# Altium schematic sheet IO Expanders.SchDoc
size A4
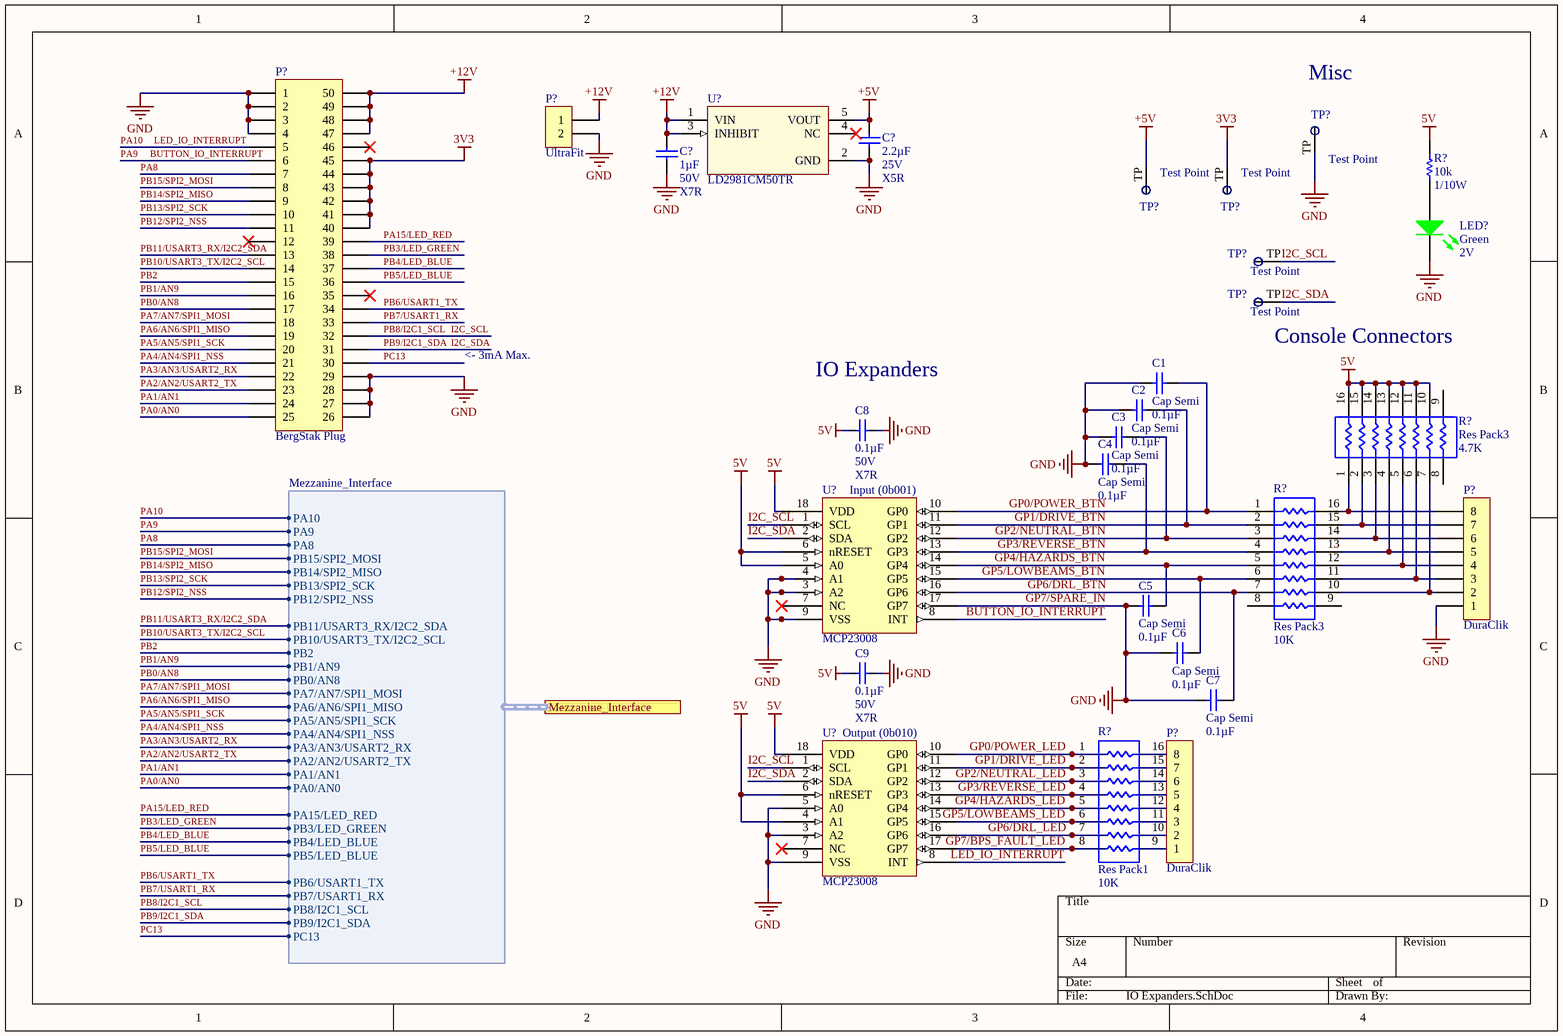
[diagram p0: IO Expanders.SchDoc]

## Parts
(Parts that share a designator on the sheet are numbered #1, #2 ... from top to bottom, then left to right.)
C1  Cap Semi  value 0.1µF  [C1206]
C2  Cap Semi  value 0.1µF  [C1206]
C3  Cap Semi  value 0.1µF  [C1206]
C4  Cap Semi  value 0.1µF  [C1206]
C5  Cap Semi  value 0.1µF  [C1206]
C6  Cap Semi  value 0.1µF  [C1206]
C7  Cap Semi  value 0.1µF  [C1206]
C8  Capacitance: 0.1µF  Voltage: 50V  Temperature Coefficient: X7R  [CAP, 0603]  (hidden comment: CAP CER 0.1UF 50V 10% X7R 0603)
C9  Capacitance: 0.1µF  Voltage: 50V  Temperature Coefficient: X7R  [CAP, 0603]  (hidden comment: CAP CER 0.1UF 50V 10% X7R 0603)
C?#1  Capacitance: 2.2µF  Voltage: 25V  Temperature Coefficient: X5R  [CAP, 0603]  (hidden comment: CAP CER 2.2UF 25V 10% X5R 0603)
C?#2  Capacitance: 1µF  Voltage: 50V  Temperature Coefficient: X7R  [CAP, 0603]  (hidden comment: CAP CER 1UF 50V 10% X7R 0603)
LED?  Color: Green  Voltage - Forward (Vf) (Typ): 2V  [LED_0603]  (hidden comment: LED GREEN CLEAR 2V 0603)
P?#1  Series: BergStak Plug  [CONN, Bergstak 50 Pos Plug]  (hidden comment: CONN 50POS Bergstak Plug 0.02")
P?#2  Series: UltraFit  [CONN, 2POS ULTRA-FIT]  (hidden comment: CONN 2POS ULTRA-FIT 0.138")
P?#3  Series: DuraClik  [CONN, 8POS Dura-Clik]  (hidden comment: CONN 8POS DURA-CLIK 0.079")
P?#4  Series: DuraClik  [CONN, 8POS Dura-Clik]  (hidden comment: CONN 8POS DURA-CLIK 0.079")
R?#1  Resistance: 10k  Power: 1/10W  [RES, 0603]  (hidden comment: RES 10K OHM 1% 1/10W 0603)
R?#2  Res Pack3  value 4.7K  [SO-16_N]
R?#3  Res Pack3  value 10K  [SO-16_N]
R?#4  Res Pack1  value 10K  [SO-16_N]
TP?#1  Test Point  [Test Point]  (no BOM)
TP?#2  Test Point  [Test Point]  (no BOM)
TP?#3  Test Point  [Test Point]  (no BOM)
TP?#4  Test Point  [Test Point]  (no BOM)
TP?#5  Test Point  [Test Point]  (no BOM)
U?#1  Manufacturer Part Number 1: LD2981CM50TR  [SOT95P280X145-5N]  (hidden comment: IC REG LDO 5V 0.1A SOT23-5)
U?#2  MCP23008  [IC 18SOIC]
U?#3  MCP23008  [IC 18SOIC]

## Ports
Mezzanine_Interface (harness Mezzanine_Interface)

## Harnesses
Mezzanine_Interface: PA10, PA9, PA8, PB15/SPI2_MOSI, PB14/SPI2_MISO, PB13/SPI2_SCK, PB12/SPI2_NSS, PB11/USART3_RX/I2C2_SDA, PB10/USART3_TX/I2C2_SCL, PB2, PB1/AN9, PB0/AN8, PA7/AN7/SPI1_MOSI, PA6/AN6/SPI1_MISO, PA5/AN5/SPI1_SCK, PA4/AN4/SPI1_NSS, PA3/AN3/USART2_RX, PA2/AN2/USART2_TX, PA1/AN1, PA0/AN0, PA15/LED_RED, PB3/LED_GREEN, PB4/LED_BLUE, PB5/LED_BLUE, PB6/USART1_TX, PB7/USART1_RX, PB8/I2C1_SCL, PB9/I2C1_SDA, PC13

## Nets
3V3: P?#1.40 P?#1.41 P?#1.42 P?#1.43 P?#1.44 P?#1.45 TP?#2.TP
5V: C8.1 C9.1 R?#1.1 R?#2.10 R?#2.11 R?#2.12 R?#2.13 R?#2.14 R?#2.15 R?#2.16 U?#2.5(A0) U?#2.6(nRESET) U?#2.18(VDD) U?#3.4(A1) U?#3.6(nRESET) U?#3.18(VDD)
+5V: C?#1.1 TP?#1.TP U?#1.5(VOUT)
+12V: C?#2.1 P?#1.47 P?#1.48 P?#1.49 P?#1.50 P?#2.1 U?#1.1(VIN) U?#1.3(INHIBIT)
GP7/SPARE_IN: C1.2 C2.2 C3.2 C4.2 C5.2 C6.2 C7.2 C8.2 C9.2 C?#1.2 C?#2.2 LED?.2(K) P?#1.1 P?#1.2 P?#1.3 P?#1.4 P?#1.26 P?#1.27 P?#1.28 P?#1.29 P?#2.2 P?#3.1 TP?#3.TP U?#1.2(GND) U?#2.3(A2) U?#2.4(A1) U?#2.9(VSS) U?#2.17(GP7) U?#3.3(A2) U?#3.5(A0) U?#3.9(VSS)  [also labelled GND]
BUTTON_IO_INTERRUPT: P?#1.6 U?#2.8(INT) ; port Mezzanine_Interface.PA9  [also labelled PA9]
GP0/POWER_BTN: C1.1 R?#3.1 U?#2.10(GP0)
GP0/POWER_LED: R?#4.1 U?#3.10(GP0)
GP1/DRIVE_BTN: C2.1 R?#3.2 U?#2.11(GP1)
GP1/DRIVE_LED: R?#4.2 U?#3.11(GP1)
GP2/NEUTRAL_BTN: C3.1 R?#3.3 U?#2.12(GP2)
GP3/REVERSE_BTN: C4.1 R?#3.4 U?#2.13(GP3)
GP3/REVERSE_LED: R?#4.4 U?#3.13(GP3)
GP4/HAZARDS_BTN: C5.1 R?#3.5 U?#2.14(GP4)
GP5/LOWBEAMS_BTN: C6.1 R?#3.6 U?#2.15(GP5)
GP6/DRL_BTN: C7.1 R?#3.7 U?#2.16(GP6)
GP6/DRL_LED: R?#4.7 U?#3.16(GP6)
I2C_SCL: P?#1.32 TP?#4.TP U?#2.1(SCL) U?#3.1(SCL) ; port Mezzanine_Interface.PB8/I2C1_SCL  [also labelled PB8/I2C1_SCL]
I2C_SDA: P?#1.31 TP?#5.TP U?#2.2(SDA) U?#3.2(SDA) ; port Mezzanine_Interface.PB9/I2C1_SDA  [also labelled PB9/I2C1_SDA]
LED_IO_INTERRUPT: P?#1.5 ; port Mezzanine_Interface.PA10  [also labelled PA10]
PA0/AN0: P?#1.25 ; port Mezzanine_Interface.PA0/AN0
PA1/AN1: P?#1.24 ; port Mezzanine_Interface.PA1/AN1
PA2/AN2/USART2_TX: P?#1.23 ; port Mezzanine_Interface.PA2/AN2/USART2_TX
PA3/AN3/USART2_RX: P?#1.22 ; port Mezzanine_Interface.PA3/AN3/USART2_RX
PA4/AN4/SPI1_NSS: P?#1.21 ; port Mezzanine_Interface.PA4/AN4/SPI1_NSS
PA5/AN5/SPI1_SCK: P?#1.20 ; port Mezzanine_Interface.PA5/AN5/SPI1_SCK
PA6/AN6/SPI1_MISO: P?#1.19 ; port Mezzanine_Interface.PA6/AN6/SPI1_MISO
PA7/AN7/SPI1_MOSI: P?#1.18 ; port Mezzanine_Interface.PA7/AN7/SPI1_MOSI
PA8: P?#1.7 ; port Mezzanine_Interface.PA8
PA15/LED_RED: P?#1.39 ; port Mezzanine_Interface.PA15/LED_RED
PB0/AN8: P?#1.17 ; port Mezzanine_Interface.PB0/AN8
PB1/AN9: P?#1.16 ; port Mezzanine_Interface.PB1/AN9
PB2: P?#1.15 ; port Mezzanine_Interface.PB2
PB3/LED_GREEN: P?#1.38 ; port Mezzanine_Interface.PB3/LED_GREEN
PB4/LED_BLUE: P?#1.37 ; port Mezzanine_Interface.PB4/LED_BLUE
PB5/LED_BLUE: P?#1.36 ; port Mezzanine_Interface.PB5/LED_BLUE
PB6/USART1_TX: P?#1.34 ; port Mezzanine_Interface.PB6/USART1_TX
PB7/USART1_RX: P?#1.33 ; port Mezzanine_Interface.PB7/USART1_RX
PB10/USART3_TX/I2C2_SCL: P?#1.14 ; port Mezzanine_Interface.PB10/USART3_TX/I2C2_SCL
PB11/USART3_RX/I2C2_SDA: P?#1.13 ; port Mezzanine_Interface.PB11/USART3_RX/I2C2_SDA
PB12/SPI2_NSS: P?#1.11 ; port Mezzanine_Interface.PB12/SPI2_NSS
PB13/SPI2_SCK: P?#1.10 ; port Mezzanine_Interface.PB13/SPI2_SCK
PB14/SPI2_MISO: P?#1.9 ; port Mezzanine_Interface.PB14/SPI2_MISO
PB15/SPI2_MOSI: P?#1.8 ; port Mezzanine_Interface.PB15/SPI2_MOSI
PC13: P?#1.30 ; port Mezzanine_Interface.PC13
NetLED?_1: LED?.1(A) R?#1.2
NetP?#3_2: P?#3.2 R?#2.7 R?#3.10
NetP?#3_3: P?#3.3 R?#2.6 R?#3.11
NetP?#3_4: P?#3.4 R?#2.5 R?#3.12
NetP?#3_5: P?#3.5 R?#2.4 R?#3.13
NetP?#3_6: P?#3.6 R?#2.3 R?#3.14
NetP?#3_7: P?#3.7 R?#2.2 R?#3.15
NetP?#3_8: P?#3.8 R?#2.1 R?#3.16
NetP?#4_1: P?#4.1 R?#4.9
NetP?#4_2: P?#4.2 R?#4.10
NetP?#4_3: P?#4.3 R?#4.11
NetP?#4_4: P?#4.4 R?#4.12
NetP?#4_5: P?#4.5 R?#4.13
NetP?#4_6: P?#4.6 R?#4.14
NetP?#4_7: P?#4.7 R?#4.15
NetP?#4_8: P?#4.8 R?#4.16
NetR?#4_3: R?#4.3 U?#3.12(GP2)
NetR?#4_5: R?#4.5 U?#3.14(GP4)
NetR?#4_6: R?#4.6 U?#3.15(GP5)
NetR?#4_8: R?#4.8 U?#3.17(GP7)

Not connected (* = marked no-connect by the designer): P?#1 12* 35* 46*; R?#2 8 9; R?#3 8 9; U?#1 4(NC)*; U?#2 7(NC)*; U?#3 7(NC)* 8(INT)

## Notes on the sheet
- (near TP?#3) Misc
- <- 3mA Max.
- (near C8) IO Expanders
- (near TP?#5) Console Connectors
- (near U?#2) Input (0b001)
- (near U?#3) Output (0b010)
- Labels drawn without touching a wire or pin: GP2/NEUTRAL_LED, GP4/HAZARDS_LED, GP5/LOWBEAMS_LED, GP7/BPS_FAULT_LED, LED_IO_INTERRUPT

## Library data of the parts
C1-C7 = Cap Semi: Capacitor (Semiconductor SIM Model); Published: 8-Jun-2000; LatestRevisionDate: 29-May-2009; LatestRevisionNote: IPC-7351 Footprint Added.; PackageReference: C1206; Publisher: Altium Limited; PackageDescription: Chip Capacitor
C8 C9 = CAP CER 0.1UF 50V 10% X7R 0603: 0.10µF ±10% 50V Ceramic Capacitor X7R 0603 (1608 Metric); Manufacturer 1: AVX Corporation; Manufacturer Part Number 1: 06035C104KAT2A; Supplier 1: Digi-Key; Supplier Part Number 1: 478-5052-1-ND; Packaging: Cut Tape (CT); Part Status: Active; Operating Temperature: -55°C ~ 125°C; Ratings: -; Mounting Type: Surface Mount, MLCC; Package / Case: 0603 (1608 Metric); Size / Dimension: 0.063" L x 0.032" W (1.60mm x 0.81mm); Height - Seated (Max): -; Thickness (Max): 0.035" (0.90mm); Lead Spacing: -; Lead Style: -; ComponentLink1URL: http://datasheets.avx.com/X7RDielectric.pdf; ComponentLink1Description: http://datasheets.avx.com/X7RDielectric.pdf; Tolerance: ±10%
C?#1 = CAP CER 2.2UF 25V 10% X5R 0603: 2.2µF ±10% 25V Ceramic Capacitor X5R 0603 (1608 Metric); Manufacturer 1: Murata Electronics North America; Manufacturer Part Number 1: GRM188R61E225KA12D; Supplier 1: Digi-Key; Supplier Part Number 1: 490-10731-1-ND; Packaging: Cut Tape (CT); Part Status: Active; Operating Temperature: -55°C ~ 85°C; Ratings: -; Mounting Type: Surface Mount, MLCC; Package / Case: 0603 (1608 Metric); Size / Dimension: 0.063" L x 0.031" W (1.60mm x 0.80mm); Height - Seated (Max): -; Thickness (Max): 0.035" (0.90mm); Lead Spacing: -; Lead Style: -; ComponentLink1URL: http://www.murata.com/~/media/webrenewal/support/library/catalog/products/capacitor/mlcc/c02e.ashx; ComponentLink1Description: http://www.murata.com/~/media/webrenewal/support/library/catalog/products/capacitor/mlcc/c02e.ashx; Tolerance: ±10%
C?#2 = CAP CER 1UF 50V 10% X7R 0603: 1µF ±10% 50V Ceramic Capacitor X7R 0603 (1608 Metric); Manufacturer 1: Taiyo Yuden; Manufacturer Part Number 1: UMK107AB7105KA-T; Supplier 1: Digi-Key; Supplier Part Number 1: 587-3247-1-ND; Packaging: Cut Tape (CT); Part Status: Active; Operating Temperature: -55°C ~ 125°C; Ratings: -; Mounting Type: Surface Mount, MLCC; Package / Case: 0603 (1608 Metric); Size / Dimension: 0.063" L x 0.031" W (1.60mm x 0.80mm); Height - Seated (Max): -; Thickness (Max): 0.037" (0.95mm); Lead Spacing: -; Lead Style: -; ComponentLink1URL: http://www.yuden.co.jp/productdata/catalog/en/mlcc_all_e.pdf; ComponentLink1Description: http://www.yuden.co.jp/productdata/catalog/en/mlcc_all_e.pdf; Tolerance: ±10%
LED? = LED GREEN CLEAR 2V 0603: Green 572nm LED Indication - Discrete 2V 0603 (1608 Metric); Manufacturer: Wurth Electronics Inc.; Manufacturer Part Number: 150060VS75000; Lens Color: Colorless; Millicandela Rating: 40mcd; Lens Style/Size: Rectangle with Flat Top, 1.10mm x 0.70mm; Current - Test: 20mA; Viewing Angle: 140°; Wavelength - Dominant: 570nm; Supplier 1: Digi-Key; RoHS: RoHS Compliant; Category: Optoelectronics; Stock 1: 9408; Pricing 1: 1=0.21, 100=0.1617, 500=0.13964 (CAD); Packaging: Cut Tape (CT); Part Status: Active; Lens Transparency: Clear; Mounting Type: Surface Mount; Wavelength - Peak: 572nm; Features: -; Package / Case: 0603 (1608 Metric); Supplier Device Package: 0603; Size / Dimension: 1.60mm L x 0.80mm W; Height (Max): 0.80mm; ComponentLink1URL: http://katalog.we-online.de/led/datasheet/150060VS75000.pdf; ComponentLink1Description: http://katalog.we-online.de/led/datasheet/150060VS75000.pdf; Supplier Part Number 1: 732-4980-1-ND
P?#1 = CONN 50POS Bergstak Plug 0.02": 50 Position Connector Plug, Outer Shroud Contacts Surface Mount Gold; Manufacturer 1: Amphenol FCI; Manufacturer Part Number 1: 10132797-055100LF; Number of Positions: 50; Mated Stacking Heights: 5mm; Pitch: 0.020" (0.50mm); Supplier 1: Digi-Key; Supplier Part Number 1: 609-5226-1-ND; Packaging: Cut Tape (CT); Part Status: Active; Connector Type: Plug, Outer Shroud Contacts; Number of Rows: 2; Mounting Type: Surface Mount; Contact Finish: Gold; Contact Finish Thickness: 1µin (0.025µm); Height Above Board: 0.169" (4.30mm); ComponentLink1URL: http://portal.fciconnect.com/Comergent//fci/drawing/10132797.pdf; ComponentLink1Description: http://portal.fciconnect.com/Comergent//fci/drawing/10132797.pdf
P?#2 = CONN 2POS ULTRA-FIT 0.138": 2 Positions Header, Shrouded Connector 0.138" (3.50mm) Through Hole Gold; Manufacturer 1: Molex, LLC; Manufacturer Part Number 1: 1722861302; Style: Board to Board or Cable; Shrouding: Shrouded - 4 Wall; Number of Positions: 2; Number of Positions Loaded: All; Contact Length - Post: 0.126" (3.20mm); Material Flammability Rating: UL94 V-0; Mated Stacking Heights: 26.99mm; Voltage: 400V; Supplier 1: Digi-Key; Supplier Part Number 1: WM11673-ND; Packaging: Tray; Part Status: Active; Connector Type: Header; Contact Type: Male Pin; Pitch - Mating: 0.138" (3.50mm); Number of Rows: 1; Row Spacing - Mating: -; Mounting Type: Through Hole; Termination: Kinked Pin, Solder; Fastening Type: Latch Holder; Contact Length - Mating: -; Overall Contact Length: -; Insulation Height: 0.465" (11.80mm); Contact Shape: Square; Contact Finish - Mating: Gold; Contact Finish Thickness - Mating: 30µin (0.76µm); Contact Finish - Post: Tin; Contact Material: Copper Alloy; Insulation Material: Liquid Crystal Polymer (LCP); Operating Temperature: -40°C ~ 120°C; Ingress Protection: -; Insulation Color: Black; Current Rating: -; Contact Finish Thickness - Post: 60µin (1.52µm); ComponentLink1URL: http://www.molex.com/pdm_docs/sd/1722861302_sd.pdf; ComponentLink1Description: http://www.molex.com/pdm_docs/sd/1722861302_sd.pdf
P?#3 P?#4 = CONN 8POS DURA-CLIK 0.079": 8 Positions Header Connector 0.079" (2.00mm) Surface Mount Tin; Manufacturer 1: Molex, LLC; Manufacturer Part Number 1: 5600200820; Style: Board to Cable/Wire; Shrouding: Shrouded - 4 Wall; Number of Positions: 8; Number of Positions Loaded: All; Mated Stacking Heights: 9.3mm; Supplier 1: Digi-Key; Supplier Part Number 1: WM10868CT-ND; Packaging: Cut Tape (CT); Part Status: Active; Connector Type: Header; Contact Type: Male Pin; Pitch - Mating: 0.079" (2.00mm); Number of Rows: 1; Row Spacing - Mating: -; Mounting Type: Surface Mount; Termination: Solder; Fastening Type: Latch Lock; Contact Length - Mating: -; Contact Length - Post: -; Overall Contact Length: -; Insulation Height: 0.315" (8.00mm); Contact Shape: Square; Contact Finish - Mating: Tin; Contact Finish Thickness - Mating: -; Contact Finish - Post: Tin; Contact Material: Copper Alloy; Insulation Material: Polyamide (PA), Nylon; Operating Temperature: -; Ingress Protection: -; Material Flammability Rating: -; Insulation Color: Natural; Current Rating: -; Contact Finish Thickness - Post: -; ComponentLink1URL: http://www.molex.com/pdm_docs/sd/5600200820_sd.pdf; ComponentLink1Description: http://www.molex.com/pdm_docs/sd/5600200820_sd.pdf; Voltage: -
R?#1 = RES 10K OHM 1% 1/10W 0603: RES SMD 10K OHM 1% 1/10W 0603; Manufacturer 1: Yageo; Manufacturer Part Number 1: RC0603FR-0710KL; Temperature Coefficient: ±100ppm/°C; Supplier 1: Digi-Key; Supplier Part Number 1: 311-10.0KHRCT-ND; Packaging: Cut Tape (CT); Part Status: Active; Composition: Thick Film; Operating Temperature: -55°C ~ 155°C; Package / Case: 0603 (1608 Metric); Supplier Device Package: 0603; Size / Dimension: 0.063" L x 0.031" W (1.60mm x 0.80mm); Height - Seated (Max): 0.022" (0.55mm); Failure Rate: -; ComponentLink1URL: http://www.yageo.com/documents/recent/PYu-RC_Group_51_RoHS_L_7.pdf; ComponentLink1Description: http://www.yageo.com/documents/recent/PYu-RC_Group_51_RoHS_L_7.pdf; Tolerance: ±1%
R?#2-R?#4 = Res Pack3: Isolated Resistor Network; Published: 24-Mar-1999; LatestRevisionDate: 29-May-2009; LatestRevisionNote: IPC-7351 Footprint Added.; PackageReference: SO-16; Publisher: Altium Limited; PackageDescription: 16-Pin Small Outline Integrated Circuit 1.27 mm Pitch; Code_JEDEC: MS-012-AC; Code_IPC: SOIC127P600-16
U?#1 = IC REG LDO 5V 0.1A SOT23-5: Linear Voltage Regulator IC Positive Fixed Output 5V 100mA SOT-23-5; Manufacturer 1: STMicroelectronics; Voltage - Dropout (Typical): 0.18V @ 100mA; Voltage - Input: Up to 16V; Supplier 1: Digi-Key; Supplier Part Number 1: 497-7787-1-ND; Packaging: Cut Tape (CT); Part Status: Active; Regulator Topology: Positive Fixed; Voltage - Output: 5V; Current - Output: 100mA; Current - Limit (Min): -; Operating Temperature: -40°C ~ 125°C; Mounting Type: Surface Mount; Package / Case: SC-74A, SOT-753; Supplier Device Package: SOT-23-5; ComponentLink1URL: http://www.st.com/content/ccc/resource/technical/document/datasheet/group1/b7/b5/a1/83/9c/bd/4a/90/CD00001635/files/CD00001635.pdf/jcr:content/translations/en.CD00001635.pdf; ComponentLink1Description: http://www.st.com/content/ccc/resource/technical/document/datasheet/group1/b7/b5/a1/83/9c/bd/4a/90/CD00001635/files/CD00001635.pdf/jcr:content/translations/en.CD00001635.pdf
U?#2 U?#3 = IC I/O EXPANDER I2C 8B 18SOIC: MCP23008 I/O Expander 8B+1Int 18P SOIC; Manufacturer: Microchip Technology; Manufacturer Part Number: MCP23008T-E/SO; Number of I/O: 8; Interface: I²C; Interrupt Output: Yes; Output Type: Push-Pull; Current - Output Source/Sink: 25mA; Voltage - Supply: 1.8 V ~ 5.5 V; Supplier 1: Digi-Key; Supplier Part Number 1: MCP23008T-E/SOCT-ND; RoHS: RoHS Compliant; Category: Integrated Circuits (ICs); Stock 1: 5607; Pricing 1: 1=1.62, 25=1.3548, 100=1.2431 (CAD); Packaging: Cut Tape (CT); Part Status: Active; Features: POR; Operating Temperature: -40°C ~ 125°C; Mounting Type: Surface Mount; Package / Case: 18-SOIC (0.295", 7.50mm Width); Supplier Device Package: 18-SOIC; ComponentLink1URL: http://www.microchip.com/mymicrochip/filehandler.aspx?ddocname=en021920; ComponentLink1Description: http://www.microchip.com/mymicrochip/filehandler.aspx?ddocname=en021920